# Altium schematic sheet LoRa.SchDoc
size A4
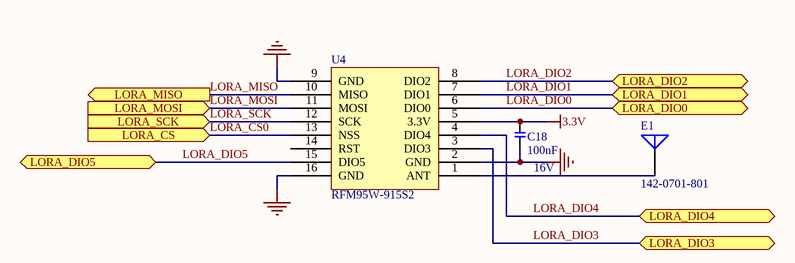
[diagram p0: LoRa.SchDoc]

## Parts
C18  Rating: 16V  [T_CAPC0603X33N]  (hidden comment: 100nF)
E1  142-0701-801  [PIN1]
U4  RFM95W-915S2  [XCVR_RFM95W-915S2]

## Ports
LORA_CS (in), LORA_DIO0 (bidir), LORA_DIO1 (bidir), LORA_DIO2 (bidir), LORA_DIO3 (bidir), LORA_DIO4 (bidir), LORA_DIO5 (bidir), LORA_MISO (out), LORA_MOSI (in), LORA_SCK (in)

## Nets
3.3V: C18.2 U4.5(3.3V)
GND: C18.1 U4.2(GND) U4.9(GND) U4.16(GND)
LORA_CS0: U4.13(NSS) ; port LORA_CS
LORA_DIO0: U4.6(DIO0) ; port LORA_DIO0
LORA_DIO1: U4.7(DIO1) ; port LORA_DIO1
LORA_DIO2: U4.8(DIO2) ; port LORA_DIO2
LORA_DIO3: U4.3(DIO3) ; port LORA_DIO3
LORA_DIO4: U4.4(DIO4) ; port LORA_DIO4
LORA_DIO5: U4.15(DIO5) ; port LORA_DIO5
LORA_MISO: U4.10(MISO) ; port LORA_MISO
LORA_MOSI: U4.11(MOSI) ; port LORA_MOSI
LORA_SCK: U4.12(SCK) ; port LORA_SCK
NetE1_1: E1.1(A) U4.1(ANT)

Not connected (* = marked no-connect by the designer): U4 14(RST)

## Library data of the parts
C18 = C-X7R-100nF-16V-10%-0603: Capacitor Ceramic X7R 100nF 16V 10% 0603; Tolerance: 10%; Type: X7R; Value: 100nF
E1 = Antenna: Generic Antenna; Published: 24-Mar-1999; LatestRevisionDate: 17-Jul-2002; LatestRevisionNote: Re-released for DXP Platform.; PackageReference: PIN1; Publisher: Altium Limited
U4 = RFM95